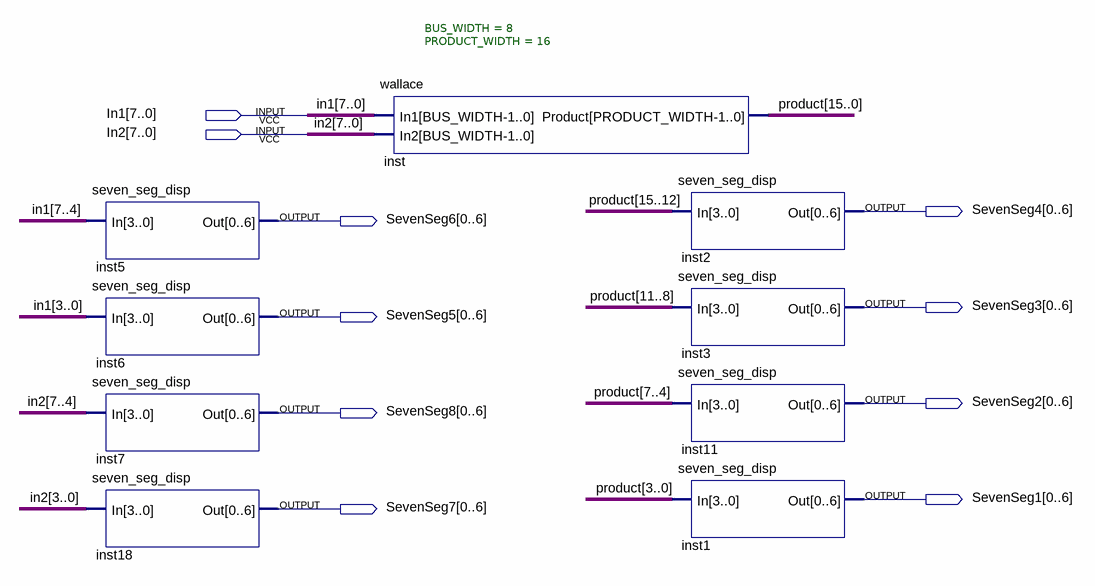
[diagram p0: schematic sheet]
// Quartus schematic wallace_full.bdf as structural Verilog: 9 symbols, 10 pins
module wallace_full (
  input  [7:0] In1,
  input  [7:0] In2,
  output [0:6] SevenSeg4,
  output [0:6] SevenSeg6,
  output [0:6] SevenSeg3,
  output [0:6] SevenSeg5,
  output [0:6] SevenSeg2,
  output [0:6] SevenSeg8,
  output [0:6] SevenSeg1,
  output [0:6] SevenSeg7
);

  wire [15:0] product;

  seven_seg_disp inst5 (.In(In1[7:4]), .Out(SevenSeg6));
  seven_seg_disp inst6 (.In(In1[3:0]), .Out(SevenSeg5));
  seven_seg_disp inst7 (.In(In2[7:4]), .Out(SevenSeg8));
  seven_seg_disp inst18 (.In(In2[3:0]), .Out(SevenSeg7));
  wallace #(.BUS_WIDTH(8), .PRODUCT_WIDTH(16)) inst (.In1(In1), .In2(In2), .Product(product));
  seven_seg_disp inst2 (.In(product[15:12]), .Out(SevenSeg4));
  seven_seg_disp inst3 (.In(product[11:8]), .Out(SevenSeg3));
  seven_seg_disp inst11 (.In(product[7:4]), .Out(SevenSeg2));
  seven_seg_disp inst1 (.In(product[3:0]), .Out(SevenSeg1));
endmodule
